# Altium schematic sheet Raspberry.SchDoc
size A4; SheetNumber: 4; SheetTotal: 6
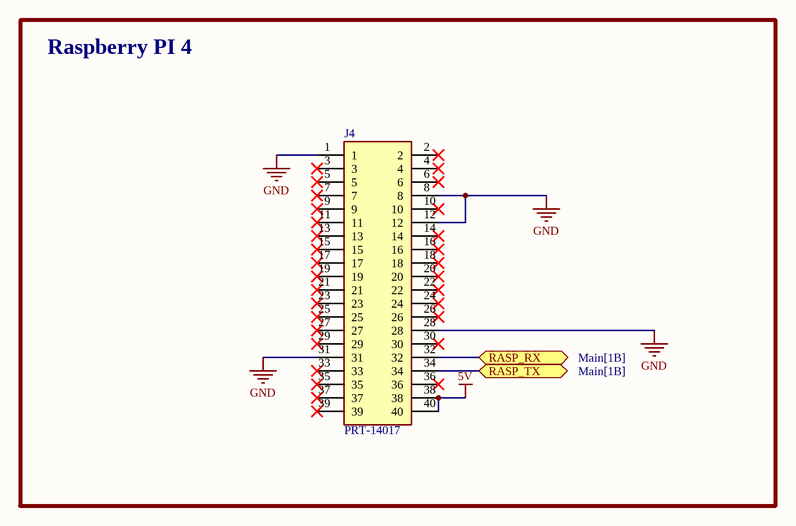
[diagram p0: Raspberry.SchDoc]

## Parts
J4  PRT-14017  [RHDR40W64P254_2X20_5130X500X1375P]

## Blocks framed on the sheet
Raspberry PI 4: J4

## Ports
RASP_RX (bidir, see Main[1B]), RASP_TX (bidir, see Main[1B])

## Nets
5V: J4.38 J4.40
GND: J4.1 J4.8 J4.12 J4.28 J4.31
RASP_RX: J4.32 ; port RASP_RX
RASP_TX: J4.34 ; port RASP_TX

Not connected (* = marked no-connect by the designer): J4 2* 3* 4* 5* 6* 7* 9* 10* 11* 13* 14* 15* 16* 17* 18* 19* 20* 21* 22* 23* 24* 25* 26* 27* 29* 30* 33* 35* 36* 37* 39*

## Library data of the parts
J4 = PRT-14017: Connector; Manufacturer_Name: SparkFun; Datasheet Link: https://componentsearchengine.com/Datasheets/1/PRT-14017.pdf; Height: 13.75mm; Manufacturer_Part_Number: PRT-14017; Mouser Part Number: 474-PRT-14017; Mouser Price/Stock: https://www.mouser.co.uk/ProductDetail/SparkFun/PRT-14017?qs=a4BXICGgSn%2F%252BaML822b65A%3D%3D; Arrow Part Number: PRT-14017; Arrow Price/Stock: https://www.arrow.com/en/products/prt-14017/sparkfun-electronics?region=nac